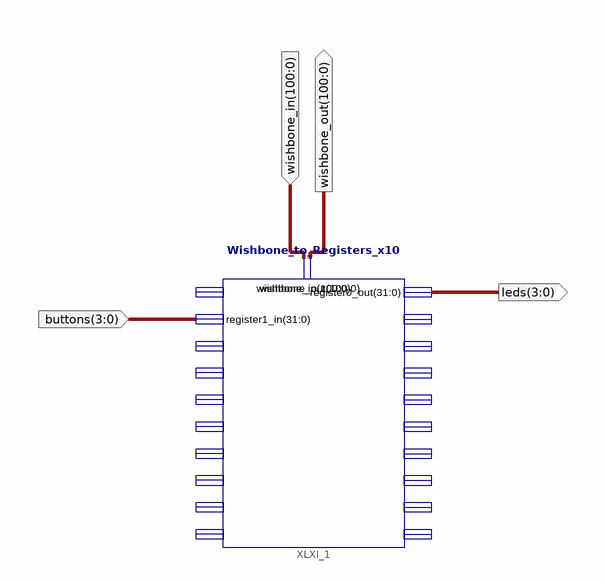
[diagram p0: schematic sheet 1]
// Xilinx ISE schematic Wishbone_Symbol_Example.sch (spartan6) as structural Verilog: 1 symbols, 4 ports
module Wishbone_Symbol_Example (
  input  [100:0] wishbone_in,
  input  [3:0] buttons,
  output [100:0] wishbone_out,
  output [3:0] leds
);

  Wishbone_to_Registers_x10 XLXI_1 (
    .register1_in(buttons), .register0_out(leds), .wishbone_in(wishbone_in), .wishbone_out(wishbone_out));  // open: register0_in, register2_in, register3_in, register4_in, register5_in, register6_in, register7_in, register8_in, register9_in, register1_out, register2_out, register3_out, register4_out, register5_out, register6_out, register7_out, register8_out, register9_out
endmodule
